# Altium schematic sheet BBU-12v蓄电池.SchDoc
size A4
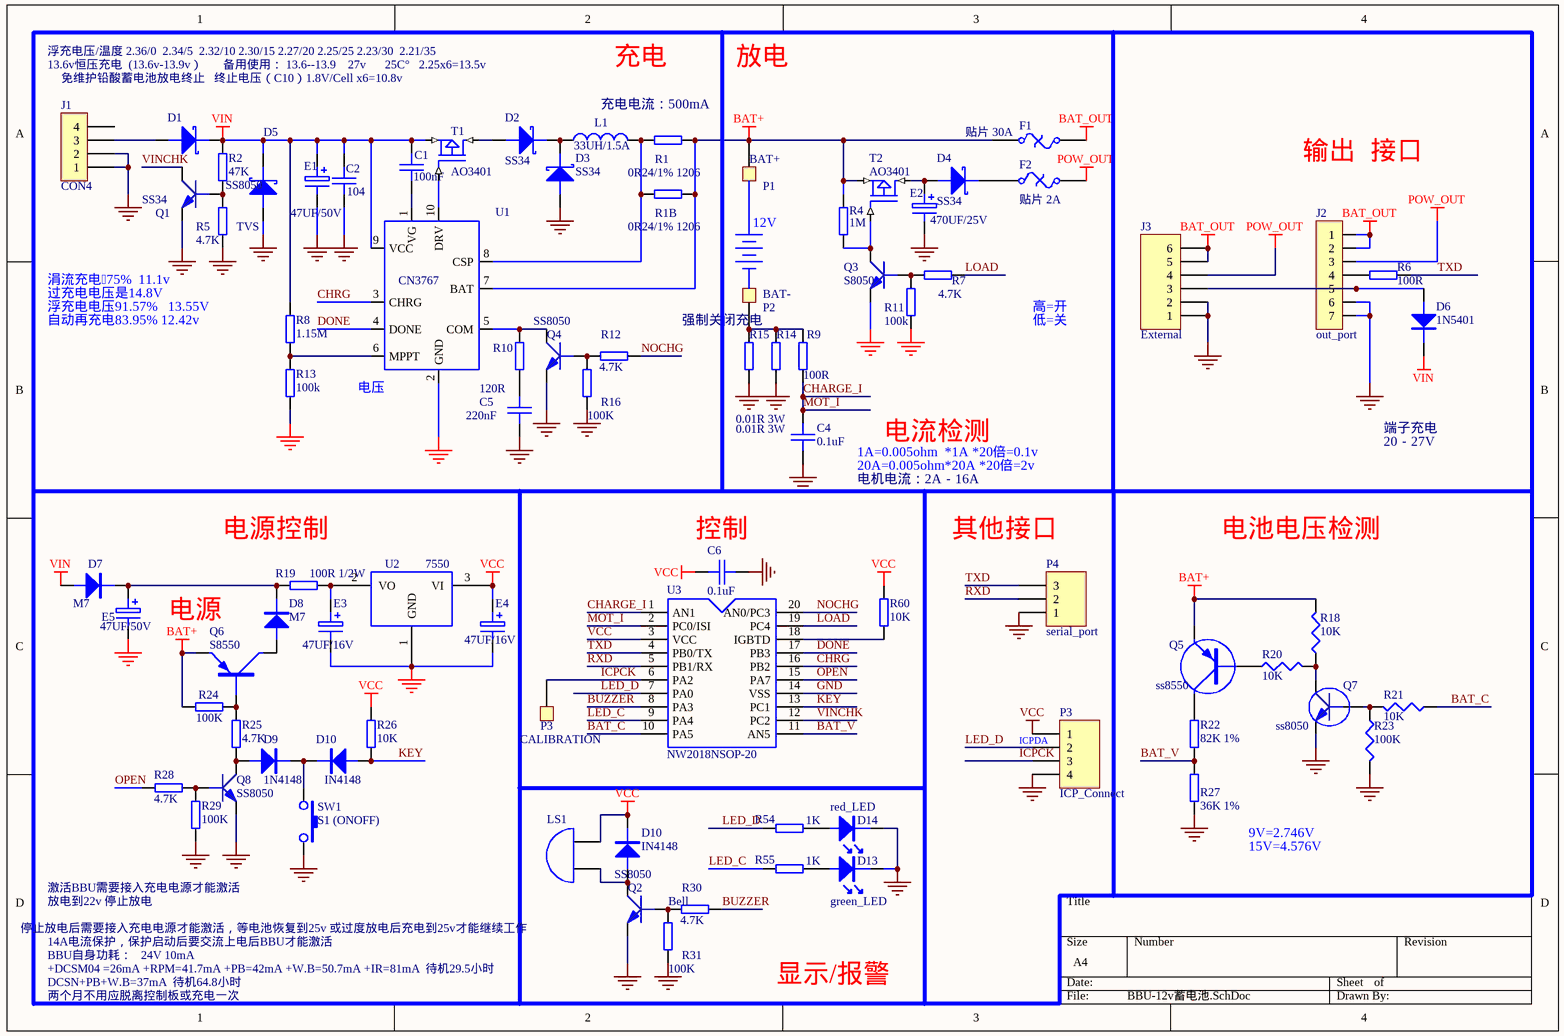
[diagram p0: BBU-12v蓄电池.SchDoc]

## Parts
(Parts that share a designator on the sheet are numbered #1, #2 ... from top to bottom, then left to right.)
C1  100nF  [0603]
C2  104  [0603]
C4  0.1uF  [0603]
C5  220nF  [0603]
C6  0.1uF  [0603]
D1  SS34  [SMA]
D2  SS34  [SMA]
D3  SS34  [SMA]
D4  SS34  [SMA]
D5  TVS  [SMA]
D6  1N5401  [SMA]
D7  M7  [SMA]
D8  M7  [SMA]
D9  1N4148  [IN4148]
D10#1  IN4148  [IN4148]
D10#2  IN4148  [IN4148]
D13  green_LED  [0603LED]
D14  red_LED  [0603LED]
E1  47UF/50V  [1206]
E2  470UF/25V  [RB3.81-GND]
E3  47UF/16V  [1206]
E4  47UF/16V  [1206]
E5  47UF/50V  [1206]
F1  贴片 30A  [1206]
F2  贴片 2A  [1206]
J1  CON4  [DC031A]
J2  out_port  [CON7-2.54MM-180-2]
J3  External  [XH2.5-6Y]
L1  33UH/1.5A  [CD53]
LS1  Bell  [Buzzer]
P1  BAT+  [mbig-1]
P2  BAT-  [mbig-1]
P3#1  CALIBRATION  [测试-焊盘 2mm]
P3#2  ICP_Connect  [HDR1X4]
P4  serial_port  [HDR1X3]
Q1  SS8050  [NPN-SMT]
Q2  SS8050  [NPN-SMT]
Q3  S8050  [NPN-SMT]
Q4  SS8050  [NPN-SMT]
Q5  ss8550  [PNP-SMT]
Q6  S8550  [PNP-SMT]
Q7  ss8050  [NPN-SMT]
Q8  SS8050  [NPN-SMT]
R1  0R24/1% 1206  [1206]
R1B  0R24/1% 1206  [1206]
R2  47K  [0603]
R4  1M  [0603]
R5  4.7K  [0603]
R6  100R  [0603]
R7  4.7K  [0603]
R8  1.15M  [0603]
R9  100R  [0603]
R10  120R  [0603]
R11  100k  [0603]
R12  4.7K  [0603]
R13  100k  [0603]
R14  0.01R 3W  [2512]
R15  0.01R 3W  [2512]
R16  100K  [0603]
R18  10K  [0603]
R19  100R 1/2W  [1206]
R20  10K  [0603]
R21  10K  [0603]
R22  82K 1%  [0603]
R23  100K  [0603]
R24  100K  [0603]
R25  4.7K  [0603]
R26  10K  [0603]
R27  36K 1%  [0603]
R28  4.7K  [0603]
R29  100K  [0603]
R30  4.7K  [0603]
R31  100K  [0603]
R54  1K  [0603]
R55  1K  [0603]
R60  10K  [0603]
SW1  S1 (ONOFF)  [KEYB]
T1  AO3401  [SOT23]
T2  AO3401  [SOT23]
U1  CN3767  [CN3767]
U2  7550  [SOT89]
U3  NW2018NSOP-20

## Nets
BAT+: F1.1 P1.1 Q5.E Q6.E R1.2 R1B.2 R4.2 R18.2 R24.1 T2.2(S) U1.7(BAT)
BAT_OUT: F1.2 J2.1 J2.2 J3.5 J3.6
GND: C2.1 C4.1 C5.1 C6.1 D3.A D5.A D13.K D14.K E1.2 E2.2 E3.2 E4.2 E5.2 J1.1 J1.2 J2.6 J2.7 J3.1 J3.2 P3#2.4 P4.1 Q1.E Q2.E Q3.E Q4.E Q7.E Q8.E R5.1 R11.1 R13.1 R14.2 R15.2 R16.2 R23.2 R27.2 R29.1 R31.2 SW1.1 U1.2(GND) U2.1(GND) U3.14(VSS)
POW_OUT: F2.1 J2.3 J3.4
VCC: C6.2 D10#2.K E4.1 LS1.2(B) P3#2.1 R26.2 R60.2 U2.3(VI) U3.3(VCC)
VIN: C1.2 C2.2 D1.K D5.K D6.K D7.A E1.1 R2.2 R8.2 T1.2(S) U1.9(VCC)
BAT_C: R21.1 U3.10(PA5)
BAT_V: R22.2 R27.1 U3.11(AN5)
BUZZER: R30.1 U3.8(PA3)
CHARGE_I: C4.2 R9.1 U3.1(AN1) U3.2(PC0/ISI)  [also labelled MOT_I]
CHRG: U1.3(CHRG) U3.16(PB2)
DONE: U1.4(DONE) U3.17(PB3)
ICPCK: P3#1.1 P3#2.3 U3.6(PA2)
KEY: D10#1.A R26.1 U3.13(PC1)
LED_C: R55.1 U3.9(PA4)
LED_D: P3#2.2 R54.1 U3.7(PA0)
LOAD: R7.2 U3.19(PC4)
NOCHG: R12.1 U3.20(AN0/PC3)
OPEN: R28.1 U3.15(PA7)
RXD: P4.2 U3.5(PB1/RX)
TXD: P4.3 R6.1 U3.4(PB0/TX)
VINCHK: Q1.C U3.12(PC2)
NetC1_1: C1.1 U1.1(VG)
NetC5_2: C5.2 R10.1
NetD1_A: D1.A J1.3
NetD2_A: D2.A T1.3(D)
NetD2_K: D2.K D3.K L1.1
NetD4_A: D4.A E2.1 T2.3(D)
NetD4_K: D4.K F2.2
NetD6_A: D6.A J2.5 J3.3
NetD7_K: D7.K D8.K E5.1 R19.1
NetD8_A: D8.A Q6.C
NetD9_A: D9.A Q8.C R25.1
NetD9_K: D9.K D10#1.K SW1.2
NetD10#2_A: D10#2.A LS1.1(A) Q2.C
NetD13_A: D13.A R55.2
NetD14_A: D14.A R54.2
NetE3_1: E3.1 R19.2 U2.2(VO)
NetJ2_4: J2.4 R6.2
NetL1_2: L1.2 R1.1 R1B.1 U1.8(CSP)
NetP2_1: P2.1 R9.2 R14.1 R15.1
NetQ1_B: Q1.B R2.1 R5.2
NetQ2_B: Q2.B R30.2 R31.1
NetQ3_B: Q3.B R7.1 R11.2
NetQ3_C: Q3.C R4.1 T2.1(G)
NetQ4_B: Q4.B R12.2 R16.1
NetQ4_C: Q4.C R10.2 U1.5(COM)
NetQ5_B: Q5.B R20.1
NetQ5_C: Q5.C R22.1
NetQ6_B: Q6.B R24.2 R25.2
NetQ7_B: Q7.B R21.2 R23.1
NetQ7_C: Q7.C R18.1 R20.2
NetQ8_B: Q8.B R28.2 R29.2
NetR8_1: R8.1 R13.2 U1.6(MPPT)
NetR60_1: R60.1 U3.18(IGBTD)
NetT1_1: T1.1(G) U1.10(DRV)

Not connected (* = marked no-connect by the designer): J1 4

## Notes on the sheet
- 13.6v恒压充电  (13.6v-13.9v）
- 浮充电压/温度 2.36/0  2.34/5  2.32/10 2.30/15 2.27/20 2.25/25 2.23/30  2.21/35
- 免维护铅酸蓄电池放电终止   终止电压（C10）1.8V/Cell x6=10.8v
- 备用使用： 13.6--13.9    27v
- 25C°   2.25x6=13.5v
- 充电电流：500mA
- 充电
- 放电
- 输出
- 接口
- 12V
- 过充电电压是14.8V
- 浮充电电压91.57%   13.55V
- 涓流充电 75%  11.1v
- 高=开
- 自动再充电83.95% 12.42v
- (near R12) 强制关闭充电
- 低=关
- (near U1) 电压
- 电流检测
- 端子充电
- 20－27V
- 电机电流：2A－16A
- 1A=0.005ohm  *1A *20倍=0.1v
- 20A=0.005ohm*20A *20倍=2v
- 电源控制
- (near C6) 控制
- 其他接口
- 电池电压检测
- 电源
- (near P3#2) ICPDA
- 15V=4.576V
- 9V=2.746V
- 放电到22v 停止放电
- 激活BBU需要接入充电电源才能激活
- 停止放电后需要接入充电电源才能激活，等电池恢复到25v 或过度放电后充电到25v才能继续工作
- BBU自身功耗：   24V 10mA
- 14A电流保护，保护启动后要交流上电后BBU才能激活
- +DCSM04 =26mA +RPM=41.7mA +PB=42mA +W.B=50.7mA +IR=81mA  待机29.5小时
- DCSN+PB+W.B=37mA  待机64.8小时
- 显示/报警
- 两个月不用应脱离控制板或充电一次

## Library data of the parts
C1 C2 C4-C6 = CAP: C?
D1-D5 = DIODE SCHOTTKY: Schottky Diode
D6 D9 D10#1 D10#2 = DIODE: D?
D7 D8 = DIODE: D?; M7: 1000V 1A
D13 D14 = LED: D?
E1-E5 = ELECTRO1
F1 F2 = Fuse Thermal: Thermal Fuse; Published: 24-Mar-1999; LatestRevisionDate: 17-Jul-2002; LatestRevisionNote: Re-released for DXP Platform.; PackageReference: PIN-W2/E2.8; Publisher: Altium Limited; PackageDescription: Thru-Hole; 2 Leads
J1 = CON4: Connector
J2 = CON7
J3 = Header 6: Header, 6-Pin; LatestRevisionDate: 17-Jul-2002; LatestRevisionNote: Re-released for DXP Platform.; Publisher: Altium Limited
L1 = INDUCTOR
LS1 = Bell: Electrical Bell; Published: 24-Mar-1999; LatestRevisionDate: 17-Jul-2002; LatestRevisionNote: Re-released for DXP Platform.; PackageReference: PIN2; Publisher: Altium Limited
P1 P2 P3#1 = Header 1
P3#2 = Header 4: Header, 4-Pin; LatestRevisionDate: 17-Jul-2002; LatestRevisionNote: Re-released for DXP Platform.; Publisher: Altium Limited
P4 = Header 3: Header, 3-Pin; LatestRevisionDate: 17-Jul-2002; LatestRevisionNote: Re-released for DXP Platform.; Publisher: Altium Limited
Q1-Q4 Q8 = NPN_1: NPN Transistor
Q5 = PNP
Q6 = PNP_1: PNP Transistor
Q7 = NPN: NPN Transistor
R1 R1B R2 R4-R16 R19 R22 R24-R31 R54 R55 R60 = RES2: R?
R18 R20 R21 R23 = RES1
SW1 = SW-PB: S?
T1 T2 = MOSFET P
U2 = 7533
U3 = JYHM1716OCS-20